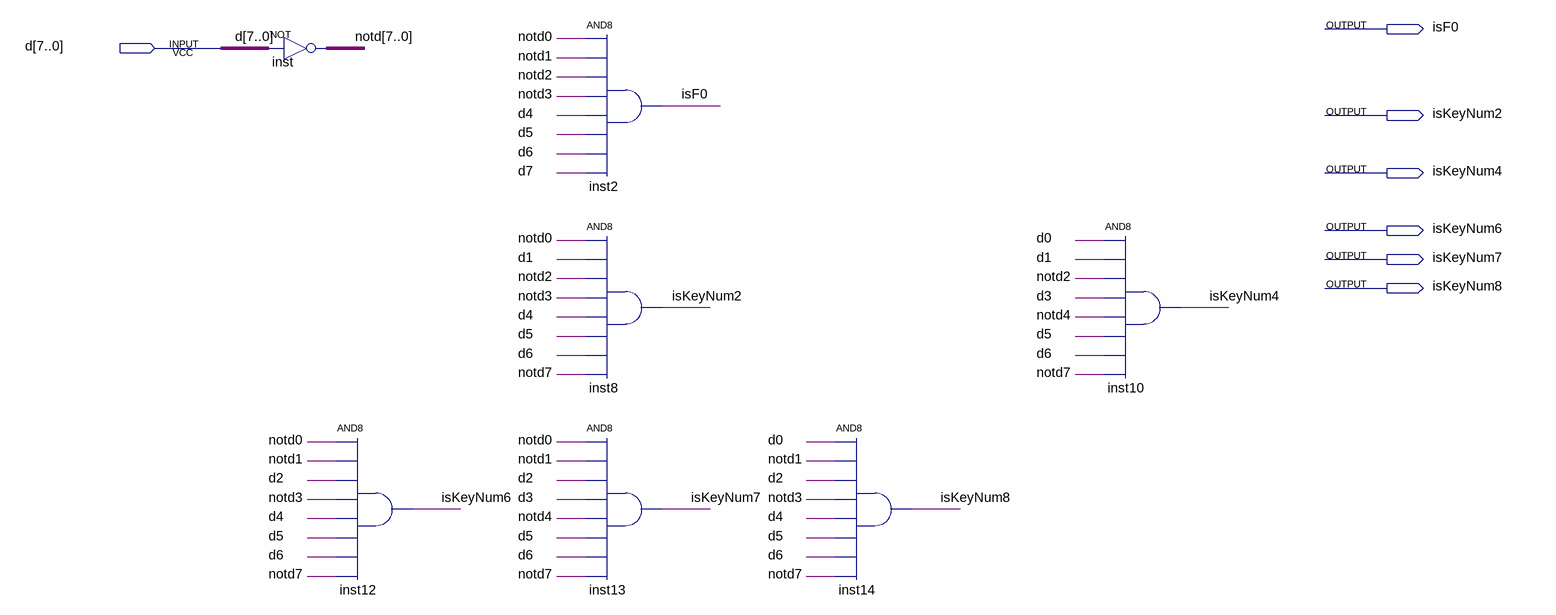
[diagram p0: schematic sheet]
// Quartus schematic KeyDetector.bdf as structural Verilog: 7 symbols, 7 pins
module KeyDetector (
  input  [7:0] d,
  output isF0,
  output isKeyNum2,
  output isKeyNum4,
  output isKeyNum6,
  output isKeyNum7,
  output isKeyNum8
);

  wire [7:0] notd;

  assign notd = ~d;  // NOT inst, 8 bits wide
  and inst12 (isKeyNum6, notd[0], notd[1], d[2], notd[3], d[4], d[5], d[6], notd[7]);
  and inst2 (isF0, notd[0], notd[1], notd[2], notd[3], d[4], d[5], d[6], d[7]);
  and inst8 (isKeyNum2, notd[0], d[1], notd[2], notd[3], d[4], d[5], d[6], notd[7]);
  and inst13 (isKeyNum7, notd[0], notd[1], d[2], d[3], notd[4], d[5], d[6], notd[7]);
  and inst14 (isKeyNum8, d[0], notd[1], d[2], notd[3], d[4], d[5], d[6], notd[7]);
  and inst10 (isKeyNum4, d[0], d[1], notd[2], d[3], notd[4], d[5], d[6], notd[7]);
endmodule
